# EAGLE design untitled (EAGLE 4.16)
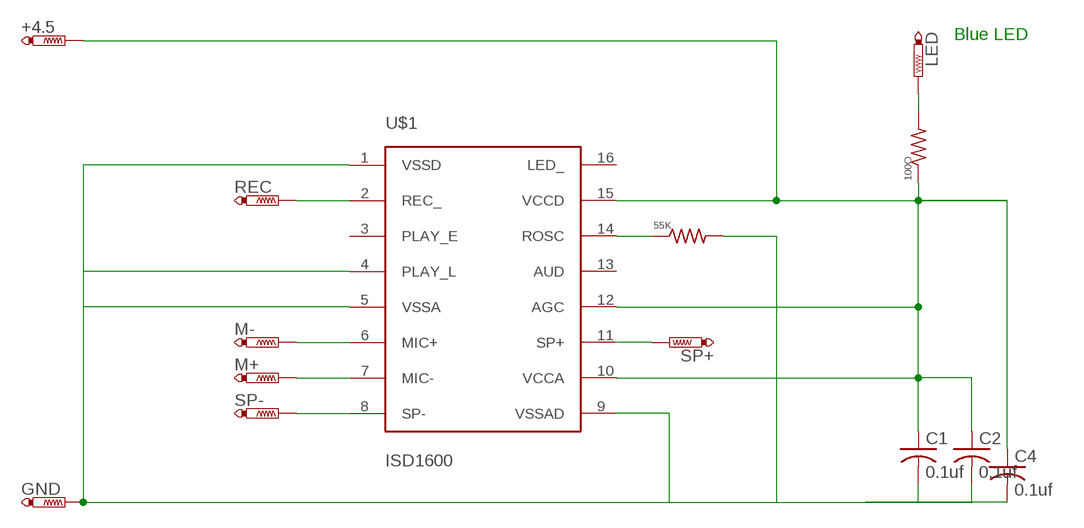
[diagram p0: schematic, sheet 1]

## Parts
55K  R-US_R0603  [R0603]
100O  R-US_R0805  [R0805]
+4.5  PTR1B1,27  [B1,27]
C1  0.1uf  C-USC0603  [C0603]
C2  0.1uf  C-USC0603  [C0603]
C4  0.1uf  C-USC0603  [C0603]
GND  PTR1B1,27  [B1,27]
LED  PTR1TP08R  [TP08R]
M+  PTR1TP12R  [TP12R]
M-  PTR1TP12R  [TP12R]
REC  PTR1TP12R  [TP12R]
SP+  PTR1TP12R  [TP12R]
SP-  PTR1TP12R  [TP12R]
U$1  ISD1600  [SO16]

## Nets
N$1: M-.TP U$1.6(MIC+)
N$2: M+.TP U$1.7(MIC-)
N$3: 55K.1 U$1.14(ROSC)
N$6: 100O.2 LED.TP
N$7: REC.TP U$1.2(REC_)
N$8: 100O.1 +4.5.PP(TP) C1.1 C2.1 C4.1 U$1.10(VCCA) U$1.12(AGC) U$1.15(VCCD)
N$9: SP-.TP U$1.8(SP-)
N$10: SP+.TP U$1.11(SP+)
REC: 55K.2 C1.2 C2.2 C4.2 GND.PP(TP) U$1.1(VSSD) U$1.4(PLAY_L) U$1.5(VSSA) U$1.9(VSSAD)
Unconnected: U$1.3(PLAY_E) U$1.13(AUD) U$1.16(LED_)

## Notes on the sheet
- Blue LED

## Library data of the parts
55K 100O = rcl:R-US_: RESISTOR, American symbol
+4.5 GND LED M+ M- REC SP+ SP- = testpad:PTR1: TEST PIN
C1 C2 C4 = rcl:C-US: CAPACITOR, American symbol
U$1 = Stofer:ISD1600

## Board
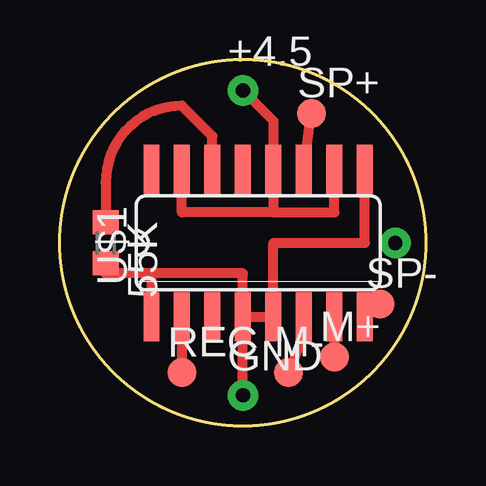
[diagram p1: board, top side]
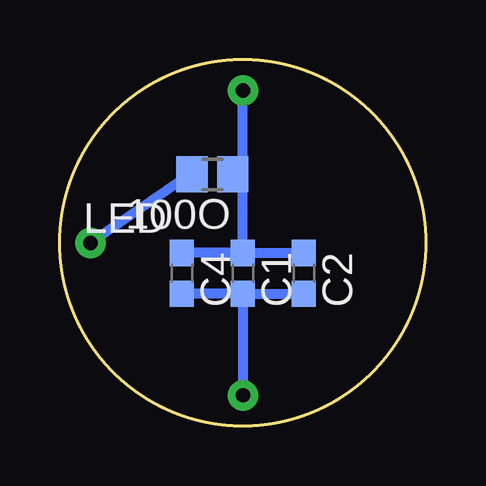
[diagram p2: board, bottom side, seen from below]

Size 15.24 x 15.24 mm. Coordinates in mm from the lower left corner, seen from the top.
Outline: circle at 7.62,7.62 radius 7.62
Copper layers (1*2+15*16): Top 0.035mm / dielectric 0.2mm / Route2 0.035mm / dielectric 0.15mm / Route15 0.035mm / dielectric 0.2mm / Bottom 0.035mm
Design rules "default": minimum track width 10mil, minimum drill 24mil, track to track 8mil, track to pad 8mil, pad to pad 8mil, via to via 8mil, smd to smd 8mil, copper to edge 40mil, drill to drill 8mil, minimum pad ring 10mil, minimum via ring 8mil, stop-mask expansion 4mil, vias tented up to drill 0mil, thermal gap 10mil

### Footprints (pad centres in the part's own frame; a part is rotated, then mirrored left to right if it is on the bottom)
R0603 = smd 1 x 1.1: 1 -0.85,0; 2 0.85,0
R0805 = smd 1.3 x 1.5: 1 -0.85,0; 2 0.85,0
B1,27 = smd 1.27 x 1.27: PP 0,0
C0603 = smd 1.1 x 1: 1 -0.85,0; 2 0.85,0
TP08R = smd 0.8 x 0.8: TP 0,0
TP12R = smd 1.2 x 1.2: TP 0,0
SO16 = smd 0.66 x 2.032: 1 0.635,-1.803; 2 1.905,-1.803; 3 3.175,-1.803; 4 4.445,-1.803; 5 5.715,-1.803; 6 6.985,-1.803; 7 8.255,-1.803; 8 9.525,-1.803; 9 9.525,4.343; 10 8.255,4.343; 11 6.985,4.343; 12 5.715,4.343; 13 4.445,4.343; 14 3.175,4.343; 15 1.905,4.343; 16 0.635,4.343

### Placement (x,y rotation side)
55K  1.91,7.62 270 top
100O  8.89,10.48 180 bottom
+4.5  7.62,13.97 0 top
C1  7.62,6.35 270 bottom
C2  5.08,6.35 270 bottom
C4  10.16,6.35 270 bottom
GND  7.62,1.27 0 top
LED  13.97,7.62 0 bottom
M+  11.43,2.86 0 top
M-  9.53,2.22 0 top
REC  5.08,2.22 0 top
SP+  10.48,13.02 0 top
SP-  13.34,5.08 0 top
U$1  3.17,6.35 0 top

### Tracks (layer width: path | path; a pad name or v marks a point on that pad's centre or on a via)
N$1
  Top 0.406: M-.TP 10.16,3.81 U$1.6
N$2
  Top 0.406: U$1.7 M+.TP
N$3
  Top 0.406: 55K.1 1.91,10.16 arc-90 5.08,13.34 6.35,12.07 U$1.14
N$6  (via drill 0.6 pad 1.27)
  Bottom 0.406: 100O.2 9.84,10.48 LED.TP
  other vias: 13.97,7.62
N$7
  Top 0.406: U$1.2 REC.TP
N$8  (via drill 0.6 pad 1.27)
  Top 0.406: U$1.10 11.43,8.89 8.89,8.89 | U$1.12 8.89,10.79 | U$1.12 8.89,8.89 | U$1.15 5.08,8.89 8.89,8.89 | U$1.12 8.89,12.7 +4.5.PP
  Bottom 0.406: C1.1 C2.1 | C1.1 C4.1 | C1.1 7.62,7.3 | C1.1 7.62,10.16 | 7.62,10.16 +4.5.PP | 100O.1 7.72,10.16 7.62,10.16
  other vias: 7.62,13.97
N$9
  Top 0.406: U$1.8 SP-.TP
N$10
  Top 0.406: U$1.11 SP+.TP
REC  (via drill 0.6 pad 1.27)
  Top 0.406: U$1.4 U$1.5 8.89,7.62 12.7,7.62 U$1.9 | U$1.4 7.62,6.35 3.81,6.35 | 3.81,4.45 U$1.1 3.81,6.35 | GND.PP U$1.4 | 1.91,6.99 55K.2 1.91,6.35 3.81,6.35
  Bottom 0.406: C1.2 C2.2 | C1.2 C4.2 | C1.2 7.62,5.4 | C1.2 GND.PP
  other vias: 7.62,1.27